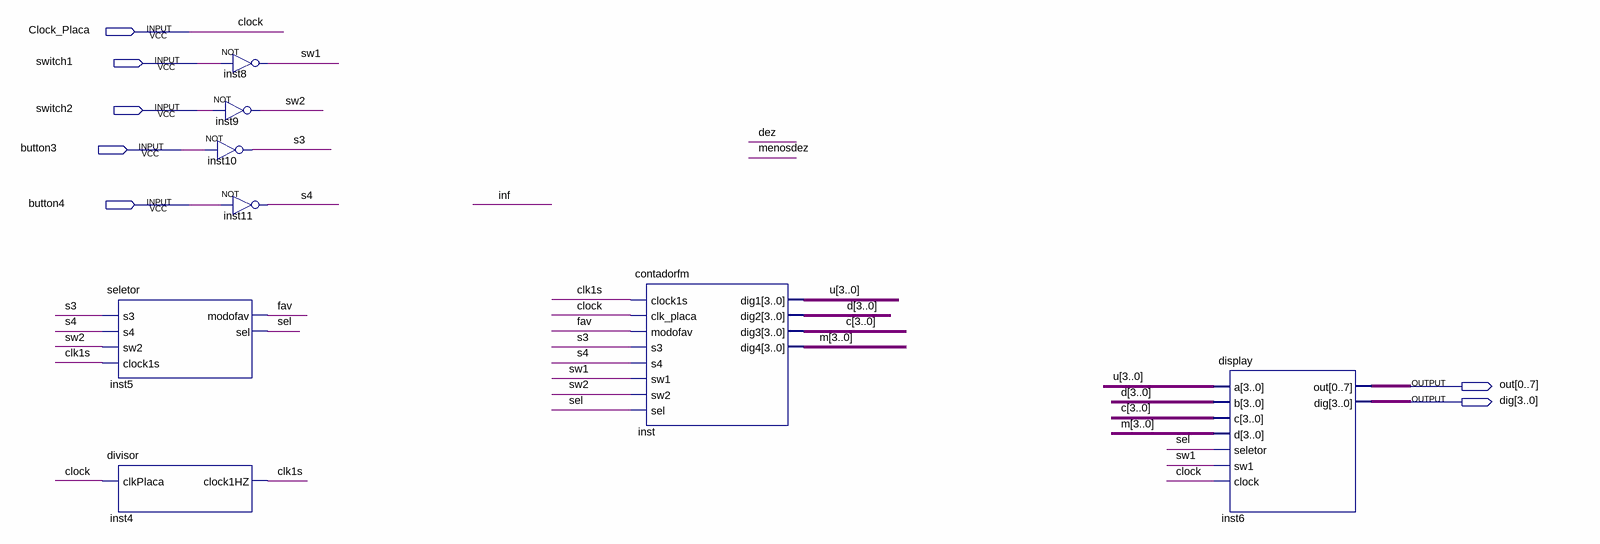
[diagram p0: schematic sheet]
// Quartus schematic testeparams.bdf as structural Verilog: 8 symbols, 7 pins
module testeparams (
  input  Clock_Placa,
  input  switch1,
  input  switch2,
  input  button3,
  input  button4,
  output [0:7] out,
  output [3:0] dig
);

  wire clk1s, fav, s3, s4, sel, sw1, sw2;
  wire [3:0] c, d, m, u;

  seletor inst5 (.s3(s3), .s4(s4), .sw2(sw2), .clock1s(clk1s), .modofav(fav), .sel(sel));
  divisor inst4 (.clkPlaca(Clock_Placa), .clock1HZ(clk1s));
  not inst8 (sw1, switch1);
  not inst9 (sw2, switch2);
  not inst10 (s3, button3);
  not inst11 (s4, button4);
  contadorfm inst (
    .clock1s(clk1s), .clk_placa(Clock_Placa), .modofav(fav), .s3(s3), .s4(s4), .sw1(sw1), .sw2(sw2),
    .sel(sel), .dig1(u), .dig2(d), .dig3(c), .dig4(m));
  display inst6 (.a(u), .b(d), .c(c), .d(m), .seletor(sel), .sw1(sw1), .clock(Clock_Placa), .out(out), .dig(dig));

  // Other names for the same wires on the sheet: clock = Clock_Placa
endmodule
